# Altium schematic sheet MOSFETPCBSchematic.SchDoc
size A
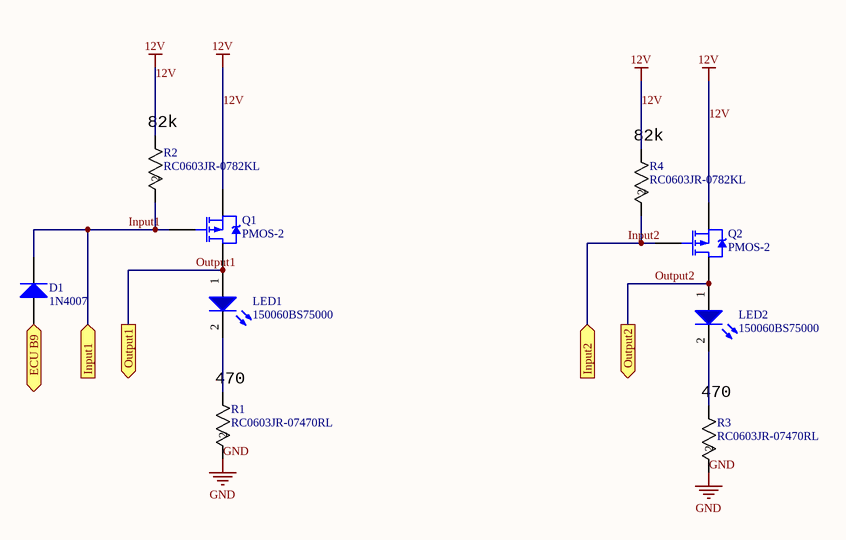
[diagram p0: MOSFETPCBSchematic.SchDoc]

## Parts
D1  1N4007  [SMC]
LED1  150060BS75000  [LED_0603_Red]
LED2  150060BS75000  [LED_0603_Blue]
Q1  PMOS-2  [SIP-G3/C6.75]
Q2  PMOS-2  [SIP-G3/C6.75]
R1  RC0603JR-07470RL  value 470  [RC0603N]
R2  RC0603JR-0782KL  value 82k  [RC0603N]
R3  RC0603JR-07470RL  value 470  [RC0603N]
R4  RC0603JR-0782KL  value 82k  [RC0603N]

## Ports
ECU B9, Input1 (in), Input2 (in), Output1 (out), Output2 (out)

## Nets
12V: Q1.3(S) Q2.3(S) R2.1 R4.1
GND: R1.2 R3.2
ECU B9: D1.1(A) ; port ECU B9
Input1: D1.2(K) Q1.1(G) R2.2 ; port Input1
Input2: Q2.1(G) R4.2 ; port Input2
Output1: LED1.1(A) Q1.2(D) ; port Output1
Output2: LED2.1(A) Q2.2(D) ; port Output2
NetLED1_2: LED1.2(C) R1.1
NetLED2_2: LED2.2(C) R3.1

## Library data of the parts
D1 = Diode: Default Diode; Published: 8-Jun-2000; LatestRevisionDate: 17-Jul-2002; LatestRevisionNote: Re-released for DXP Platform.; PackageVersion: Sep-1996; PackageReference: SMC; Publisher: Altium Limited; PackageDescription: DO-214-AB/SMC; 2 C-Bend Leads; Body 7.9 x 5.9 mm, inc. leads (LxW); Code_JEDEC: DO-214-AB
LED1 LED2 = WL-SMCW 0603  150060BS75000: SMD mono-color Chip LED, WL-SMCW, Blue; Manufacturer: W黵th Elektronik eiSos GmbH; PartNo: 150060BS75000; ComponentLink1Description: Manufacturer; ComponentLink1URL: http://www.we-online.de; Created by: Christin Otto; Created Date: June 2013; ComponentLink2Description: Datasheet; ComponentLink2URL: http://katalog.we-online.com/led/datasheet/150060BS75000.pdf; Color: Blue
Q1 Q2 = PMOS-2: P-Channel Power MOSFET; Note: Pin 4 not drawn and electrically connected to Pin 2.; Published: 8-Jun-2000; LatestRevisionDate: 17-Jul-2002; LatestRevisionNote: Re-released for DXP Platform.; DatasheetVersion: PD-9.390D; PackageVersion: Feb-1997; PackageReference: TO-220AB; Publisher: Altium Limited; PackageDescription: TO, Thru-Hole, Vertical, Heatsink Mounted; 3 In-Line Leads; Pitch 2.54 mm; ComponentLink1Description: Manufacturer Link; ComponentLink1URL: http://www.irf.com/
R1 R3 = RC0603JR-07470RL: Imported; Vendor: Yageo; Power (Watts): 0.1W, 1/10W; Tolerance: Â±5%; Voltage - Working: 50V; Temperature Coefficient: Â±100ppm/Â°C; C: Copyright (C) 2015 Accelerated Designs. All rights reserved; DigiKeyPartNumber: 311-470GRTR-ND; Manufacturer_Part_Number: RC0603JR-07470RL; Quantity_Available: 0; DataSheet: http://www.yageo.com/documents/recent/PYu-RC0603_51_RoHS_L_4.pdf; Resistance In Ohms: 470; Lead Style: Surface Mount (SMD - SMT); Case: 0603 (1608 metric); Packaging: Tape &amp; Reel (TR); Composition: Thick Film; NewarkPartNumber: 66R2764; Resistance (Ohms): 470; Features: -; Package / Case: 0603 (1608 Metric); Size / Dimension: 0.063" L x 0.031" W (1.60mm x 0.80mm); Height: 0.022" (0.55mm); Number of Terminations: 2; Copyright: Copyright (C) 2015 Accelerated Designs. All rights reserved; RefDes: RefDes; Type: DEV
R2 R4 = RC0603JR-0782KL: Imported; Vendor: Yageo; Resistance In Ohms: 82.0K; Power (Watts): 0.1W, 1/10W; Tolerance: Â±5%; Voltage - Working: 50V; Temperature Coefficient: Â±100ppm/Â°C; C: Copyright (C) 2015 Accelerated Designs. All rights reserved; DigiKeyPartNumber: 311-82KGRTR-ND; Manufacturer_Part_Number: RC0603JR-0782KL; Quantity_Available: 35000; DataSheet: http://www.yageo.com/documents/recent/PYu-RC0603_51_RoHS_L_4.pdf; Lead Style: Surface Mount (SMD - SMT); Case: 0603 (1608 metric); Packaging: Tape &amp; Reel (TR); Composition: Thick Film; NewarkPartNumber: 66R2803; Resistance (Ohms): 82K; Features: -; Package / Case: 0603 (1608 Metric); Size / Dimension: 0.063" L x 0.031" W (1.60mm x 0.80mm); Height: 0.022" (0.55mm); Number of Terminations: 2; Copyright: Copyright (C) 2015 Accelerated Designs. All rights reserved; RefDes: RefDes; Type: DEV